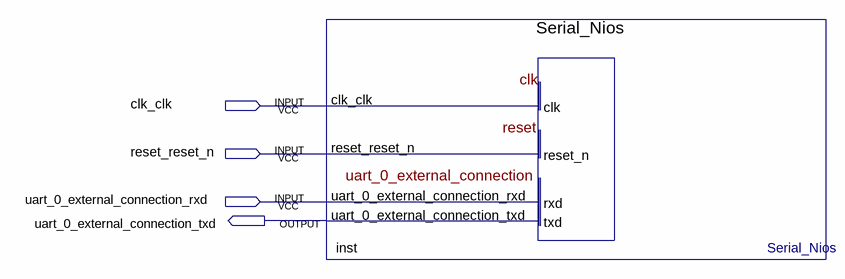
[diagram p0: schematic sheet]
// Quartus schematic Block1.bdf as structural Verilog: 1 symbols, 4 pins
module Block1 (
  input  clk_clk,
  input  reset_reset_n,
  input  uart_0_external_connection_rxd,
  output uart_0_external_connection_txd
);

  Serial_Nios inst (
    .clk_clk(clk_clk), .reset_reset_n(reset_reset_n),
    .uart_0_external_connection_rxd(uart_0_external_connection_rxd),
    .uart_0_external_connection_txd(uart_0_external_connection_txd));
endmodule
